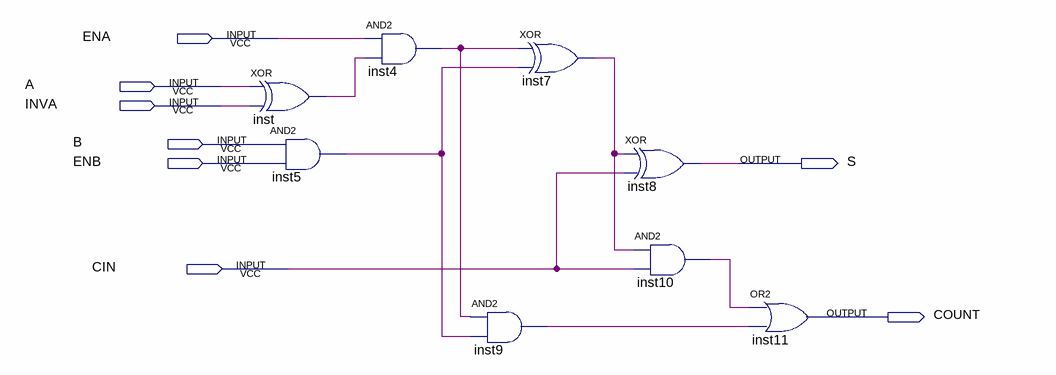
[diagram p0: schematic sheet]
// Quartus schematic full_adder_1bit.bdf as structural Verilog: 8 symbols, 8 pins
module full_adder_1bit (
  input  ENA,
  input  A,
  input  INVA,
  input  B,
  input  ENB,
  input  CIN,
  output S,
  output COUNT
);

  wire inst4_out, inst5_out, inst7_out, inst9_out, inst10_out, inst_out;

  xor inst (inst_out, A, INVA);
  and inst5 (inst5_out, B, ENB);
  and inst4 (inst4_out, ENA, inst_out);
  and inst9 (inst9_out, inst4_out, inst5_out);
  xor inst7 (inst7_out, inst4_out, inst5_out);
  xor inst8 (S, inst7_out, CIN);
  and inst10 (inst10_out, inst7_out, CIN);
  or inst11 (COUNT, inst10_out, inst9_out);
endmodule
